# Altium schematic sheet Jack.SchDoc
size Tabloid; Organization: Altium Limited; Address1: L3, 12a Rodborough Rd; Address2: Frenchs Forest; Address3: NSW; Address4: Australia 2086; DocumentNumber: 8; SheetNumber: 8; SheetTotal: 8
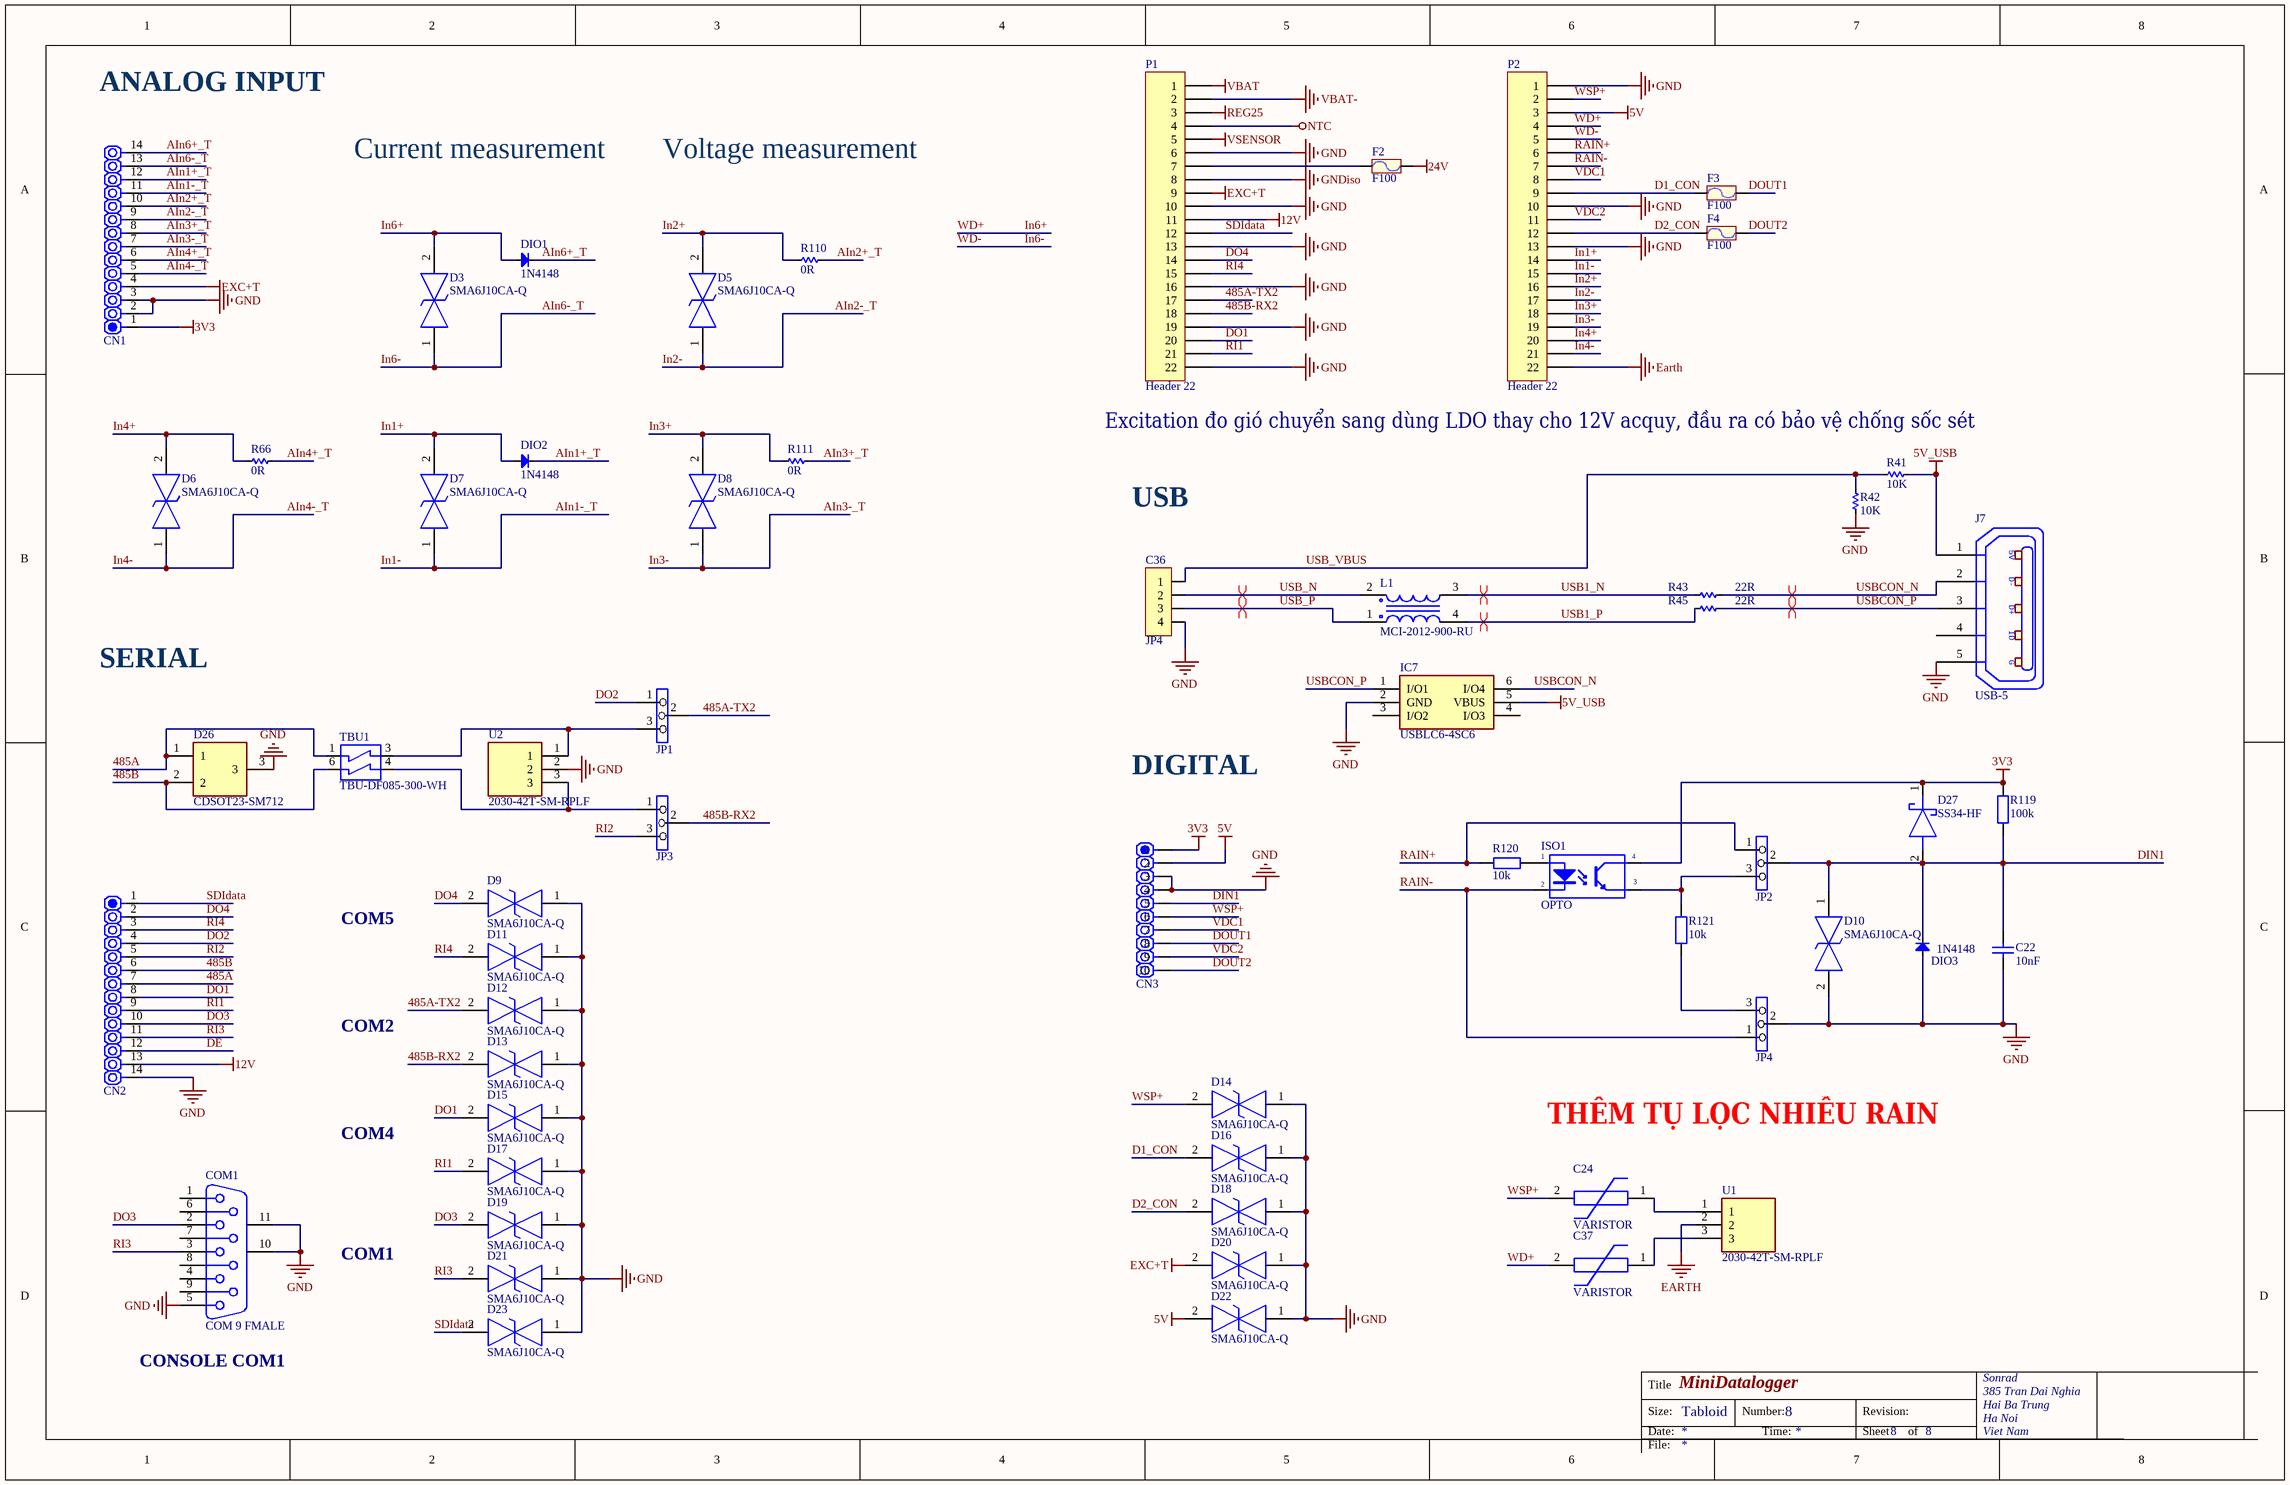
[diagram p0: Jack.SchDoc]

## Parts
C22  10nF  [0805 CAP]
C24  VARISTOR  [CN2]
C36  JP4  [JP4-C1T]
C37  VARISTOR  [CN2]
CN1  CON.HDR1x14  [CON1X14N]  (value not drawn)
CN2  CON.HDR1x14  [CON1X14N]  (value not drawn)
CN3  CON.HDR1x10  [HDR1X10]  (value not drawn)
COM1  COM 9 FMALE  [61800925123]
D3  SMA6J10CA-Q  [DIONM5127X229N]
D5  SMA6J10CA-Q  [DIONM5127X229N]
D6  SMA6J10CA-Q  [DIONM5127X229N]
D7  SMA6J10CA-Q  [DIONM5127X229N]
D8  SMA6J10CA-Q  [DIONM5127X229N]
D9  SMA6J10CA-Q  [DIONM5127X229N]
D10  SMA6J10CA-Q  [DIONM5127X229N]
D11  SMA6J10CA-Q  [DIONM5127X229N]
D12  SMA6J10CA-Q  [DIONM5127X229N]
D13  SMA6J10CA-Q  [DIONM5127X229N]
D14  SMA6J10CA-Q  [DIONM5127X229N]
D15  SMA6J10CA-Q  [DIONM5127X229N]
D16  SMA6J10CA-Q  [DIONM5127X229N]
D17  SMA6J10CA-Q  [DIONM5127X229N]
D18  SMA6J10CA-Q  [DIONM5127X229N]
D19  SMA6J10CA-Q  [DIONM5127X229N]
D20  SMA6J10CA-Q  [DIONM5127X229N]
D21  SMA6J10CA-Q  [DIONM5127X229N]
D22  SMA6J10CA-Q  [DIONM5127X229N]
D23  SMA6J10CA-Q  [DIONM5127X229N]
D26  CDSOT23-SM712  [SOT95P230X117-3N]
D27  SS34-HF  [DIOM5025X220N]
DIO1  1N4148  [DIO-SMD-123]
DIO2  1N4148  [DIO-SMD-123]
DIO3  1N4148  [DIO-SMD-123]
F2  F100  [Fuse1A]
F3  F100  [Fuse1A]
F4  F100  [Fuse1A]
IC7  USBLC6-4SC6  [SOT95P280X145-6N]
ISO1  OPTO  [PC817 SMD]
J7  USB-5  [USB_B_MINI_SMD]
JP1  Jumper 3 pins  [Header 3]  (value not drawn)
JP2  Jumper 3 pins  [Header 3]  (value not drawn)
JP3  Jumper 3 pins  [Header 3]  (value not drawn)
JP4  Jumper 3 pins  [Header 3]  (value not drawn)
L1  MCI-2012-900-RU  [MCI-2012-900-RU]
P1  Header 22  [KF250_KEFA_22P_PHOENIX]
P2  Header 22  [KF250_KEFA_22P_PHOENIX]
R41  10K  [RES-SMD-0805]
R42  10K  [RES-SMD-0805]
R43  22R  [RES-SMD-0805]
R45  22R  [RES-SMD-0805]
R66  0R  [RES-SMD-0805]
R110  0R  [RES-SMD-0805]
R111  0R  [RES-SMD-0805]
R119  100k  [SM-0805]
R120  10k  [SM-0805]
R121  10k  [SM-0805]
TBU1  TBU-DF085-300-WH  [TBU-DF085-300-WH]
U1  2030-42T-SM-RPLF  [203042TSMRPLF]
U2  2030-42T-SM-RPLF  [203042TSMRPLF]

## Nets
3V3: CN1.1 CN3.1 D27.1(K) ISO1.4(C) R119.2
5V: CN3.2 D22.2 P2.3
5V_USB: IC7.5(VBUS) J7.1(P1) R41.1
12V: CN2.13 P1.11
24V: F2.2
Earth: P2.22 U1.2
EXC+T: CN1.4 D20.2 P1.9
GND: C22.1 C36.4 CN1.2 CN1.3 CN2.14 CN3.3 CN3.4 COM1.5 COM1.10(MH1) COM1.11(MH2) D9.1 D10.2 D11.1 D12.1 D13.1 D14.1 D15.1 D16.1 D17.1 D18.1 D19.1 D20.1 D21.1 D22.1 D23.1 D26.3 DIO3.1(A) IC7.2(GND) J7.5(P5) JP4.2 P1.6 P1.10 P1.13 P1.16 P1.19 P1.22 P2.1 P2.10 P2.13 R42.2 U2.2
GNDiso: P1.8
NTC: P1.4
REG25: P1.3
VBAT: P1.1
VBAT-: P1.2
VSENSOR: P1.5
485A: CN2.7 D26.1 TBU1.1(IN1)
485A-TX2: D12.2 JP1.2 P1.17
485B: CN2.6 D26.2 TBU1.6
485B-RX2: D13.2 JP3.2 P1.18
AIn1+_T: CN1.12 DIO2.2(K)
AIn1-_T: CN1.11 D7.1 P2.15  [also labelled In1-]
AIn2+_T: CN1.10 R110.1
AIn2-_T: CN1.9 D5.1 P2.17  [also labelled In2-]
AIn3+_T: CN1.8 R111.1
AIn3-_T: CN1.7 D8.1 P2.19  [also labelled In3-]
AIn4+_T: CN1.6 R66.1
AIn4-_T: CN1.5 D6.1 P2.21  [also labelled In4-]
AIn6+_T: CN1.14 DIO1.2(K)
AIn6-_T: CN1.13 D3.1 P2.5  [also labelled In6-, WD-]
D1_CON: D16.2 F3.1 P2.9
D2_CON: D18.2 F4.1 P2.12
DE: CN2.12
DIN1: C22.2 CN3.5 D10.1 D27.2(A) DIO3.2(K) JP2.2 R119.1
DO1: CN2.8 D15.2 P1.20
DO2: CN2.4 JP1.1
DO3: CN2.10 COM1.2 D19.2
DO4: CN2.2 D9.2 P1.14
DOUT1: CN3.8 F3.2
DOUT2: CN3.10 F4.2
In1+: D7.2 DIO2.1(A) P2.14
In2+: D5.2 P2.16 R110.2
In3+: D8.2 P2.18 R111.2
In4+: D6.2 P2.20 R66.2
In6+: C37.2 D3.2 DIO1.1(A) P2.4  [also labelled WD+]
RAIN+: JP2.1 P2.6 R120.1
RAIN-: ISO1.2(K) JP4.1 P2.7
RI1: CN2.9 D17.2 P1.21
RI2: CN2.5 JP3.3
RI3: CN2.11 COM1.3 D21.2
RI4: CN2.3 D11.2 P1.15
SDIdata: CN2.1 D23.2 P1.12
USB1_N: L1.3 R43.2
USB1_P: L1.4 R45.2
USB_N: C36.2 L1.2
USB_P: C36.3 L1.1
USB_VBUS: C36.1 R41.2 R42.1
USBCON_N: IC7.6(I/O4) J7.2(P2) R43.1
USBCON_P: IC7.1(I/O1) J7.3(P3) R45.1
VDC1: CN3.7 P2.8
VDC2: CN3.9 P2.11
WSP+: C24.2 CN3.6 D14.2 P2.2
NetC24_1: C24.1 U1.1
NetC37_1: C37.1 U1.3
NetF2_1: F2.1 P1.7
NetISO1_1: ISO1.1(A) R120.2
NetISO1_3: ISO1.3(E) JP2.3 R121.1
NetJP1_3: JP1.3 TBU1.3(IN1) U2.1
NetJP3_1: JP3.1 TBU1.4(IN1) U2.3
NetJP4_3: JP4.3 R121.2

Not connected (* = marked no-connect by the designer): COM1 1 4 6 7 8 9; IC7 3(I/O2) 4(I/O3); J7 4(P4)

## Layout directives
differential pair; differential pair class USB: USB1_N, USB1_P, USB_N, USB_P, USBCON_N, USBCON_P

## Notes on the sheet
- ANALOG INPUT
- Current measurement
- Voltage measurement
- Excitation đo gió chuyển sang dùng LDO thay cho 12V acquy, đầu ra có bảo vệ chống sốc sét
- USB
- SERIAL
- DIGITAL
- COM5
- COM2
- COM4
- THÊM TỤ LỌC NHIỄU RAIN
- COM1
- (near COM1) CONSOLE COM1
- Title
- Size:
- Date:
- MiniDatalogger
- Tabloid
- Number:
- Time:
- Revision:
- Sheet
- of
- Sonrad
- 385 Tran Dai Nghia
- Hai Ba Trung
- Ha Noi
- Viet Nam
- File:
- (in symbol USB-5) 5V; D-; D+; ID; G

## Library data of the parts
C22 = CAP CERAMIC: Published: 8-Jun-2000; LatestRevisionDate: 17-Jul-2002; LatestRevisionNote: Re-released for DXP Platform.; PackageReference: RAD-0.3; Publisher: Altium Limited
C24 C37 = VARISTOR: Value: VR 10K
C36 = JP4: WR-PHD 2.54 mm Angled Socket Header; Manufacturer: W¨¹rth Elektronik eiSos GmbH; partNo: 613004143121; ComponentLink1 Description: Manufacturer; ComponentLink2 Description: Datasheet; NoPins: 04; Created Date: 29 March 2013; ComponentLink1URL: http://www.we-online.com; ComponentLink2URL: http://katalog.we-online.de/em/datasheet/6130xx143121.pdf; Created by: Karrer Zheng
CN1 CN2 = CON.HDR1x14: Header 1x14; Publisher: Hoang Nguyen; ComponentLink1Description: Digikey Part link; ComponentLink2Description: Open DataSheet; ComponentLink2URL: H:\LIBRARY\LIBRARY.Datasheet\
CN3 = CON.HDR1x10: Header 1x10; Publisher: Hoang Nguyen; ComponentLink1Description: Digikey Part link; ComponentLink2Description: Open DataSheet; ComponentLink2URL: H:\LIBRARY\LIBRARY.Datasheet\
COM1 = DSB9F: COM 9; PackageDocument: O; Positions: 9; Gender: Receptacle; Value: COM 9; Published: 15-Jun-2001; LatestRevisionDate: 17-Jul-2002; LatestRevisionNote: Re-released for DXP Platform.; DatasheetDocument: 1-Sep-1999; PackageReference: 788750; Publisher: Altium Limited; Orientation: Right Angle
D3 D5-D23 = SMA6J10CA-Q: TVS Diode (Bi-directional); Manufacturer_Name: Bourns; Datasheet Link: https://www.bourns.com/docs/product-datasheets/sma6j-q.pdf?sfvrsn=4a9a7af6_53; Height: 2.29mm; Manufacturer_Part_Number: SMA6J10CA-Q; Mouser Part Number: 652-SMA6J10CA-Q; Mouser Price/Stock: https://www.mouser.co.uk/ProductDetail/Bourns/SMA6J10CA-Q?qs=BJlw7L4Cy79QGk2EpmeXhg%3D%3D
D26 = CDSOT23-SM712: Diode; Manufacturer_Name: Bourns; Datasheet Link: http://uk.rs-online.com/web/p/products/7673728; Height: 1.17mm; Manufacturer_Part_Number: CDSOT23-SM712; Mouser Part Number: 652-CDSOT23-SM712; Mouser Price/Stock: https://www.mouser.co.uk/ProductDetail/Bourns/CDSOT23-SM712?qs=FuI%252BOVLl4%2FLTY%2FGQ265RLA%3D%3D; Arrow Part Number: CDSOT23-SM712; Arrow Price/Stock: https://www.arrow.com/en/products/cdsot23-sm712/bourns
D27 = SS34-HF: Schottky Diode; Manufacturer_Name: Comchip Technology; Datasheet Link: https://ms.componentsearchengine.com/Datasheets/1/SS34-HF.pdf; Height: 2.2mm; Manufacturer_Part_Number: SS34-HF; Mouser Part Number: 750-SS34-HF; Mouser Price/Stock: https://www.mouser.co.uk/ProductDetail/Comchip-Technology/SS34-HF?qs=%252B6g0mu59x7Kt0FF4l3l3pg%3D%3D; Arrow Part Number: SS34-HF; Arrow Price/Stock: https://www.arrow.com/en/products/ss34-hf/comchip-technology
DIO1-DIO3 = Diode SMD: Default Diode; Code - JEDEC: DO-214-AB; Value: 1N5007; Published: 8-Jun-2000; Revision: July-2002: Re-released for DXP Platform.; Publisher: Altium Limited
F2-F4 = Fuse: Designed by: VanDungEvn; Value: Fuse
IC7 = USBLC6-4SC6: Integrated Circuit; Manufacturer_Name: STMicroelectronics; Datasheet Link: http://www.st.com/st-web-ui/static/active/en/resource/technical/document/datasheet/CD00047494.pdf; Height: 1.45mm; Manufacturer_Part_Number: USBLC6-4SC6; Mouser Part Number: 511-USBLC6-4SC6; Mouser Price/Stock: https://www.mouser.co.uk/ProductDetail/STMicroelectronics/USBLC6-4SC6?qs=k9dH%2Fx4GHJCNdehb8zInZg%3D%3D; Arrow Part Number: USBLC6-4SC6; Arrow Price/Stock: https://www.arrow.com/en/products/usblc6-4sc6/stmicroelectronics?region=nac
ISO1 = OPTO: Value: TLP5211
J7 = USB-5: Manufacturer: FCI; Manufacturer Part Number: 10118193-0001LF; Connector Type: USB - micro B; Number of Contacts: 5; Gender: Receptacle; Specifications: USB 2.0; .Creator: MM; .Checked PCB: RF; Supplier 1: Digi-Key; RoHS: RoHS Compliant; Category: Connectors, Interconnects; Stock 1: 28642; Pricing 1: 1=0.46, 10=0.433, 25=0.3712, 50=0.3156, 100=0.3032, 250=0.27224, 500=0.25988 (USD); Packaging: Cut Tape (CT); Mounting Type: Surface Mount, Right Angle, Horizontal; Features: Shielded, Solder Retention; Ingress Protection: -; ComponentLink1URL: http://portal.fciconnect.com/Comergent//fci/drawing/10118193.pdf; ComponentLink1Description: http://portal.fciconnect.com/Comergent//fci/drawing/10118193.pdf; Supplier Part Number 1: 609-4616-1-ND; .Checked SCH: MM
JP1-JP4 = Jumper3: ECCN_US/EU: n/a
R41-R43 R45 R66 R110 R111 = Res-SMD: Resistor; Manufacturer: Generic Components; Class: Passive; Published: 08/06/2000; Publisher: Altium Hobart Technology Centre
R119-R121 = RM: Resistor SMD; Value: 1K
U1 U2 = 2030-42T-SM-RPLF: Undefined or Miscellaneous; Manufacturer_Name: Bourns; Datasheet Link: https://www.mouser.com/datasheet/2/54/030-xxt-sm-776307.pdf; Height: 5.3mm; Manufacturer_Part_Number: 2030-42T-SM-RPLF; Mouser Part Number: 652-2030-42T-SM-RPLF; Mouser Price/Stock: https://www.mouser.co.uk/ProductDetail/Bourns/2030-42T-SM-RPLF?qs=5MvhVKkHFQUQcmaLkL8YYA%3D%3D; Arrow Part Number: 2030-42T-SM-RPLF; Arrow Price/Stock: https://www.arrow.com/en/products/2030-42t-sm-rplf/bourns
P1 P2 = Header 22: LatestRevisionDate: 17-Jul-2002; LatestRevisionNote: Re-released for DXP Platform.; Publisher: Altium Limited